# EAGLE board serv_open8_tsmc (EAGLE 9.6.2), part 1 of 2
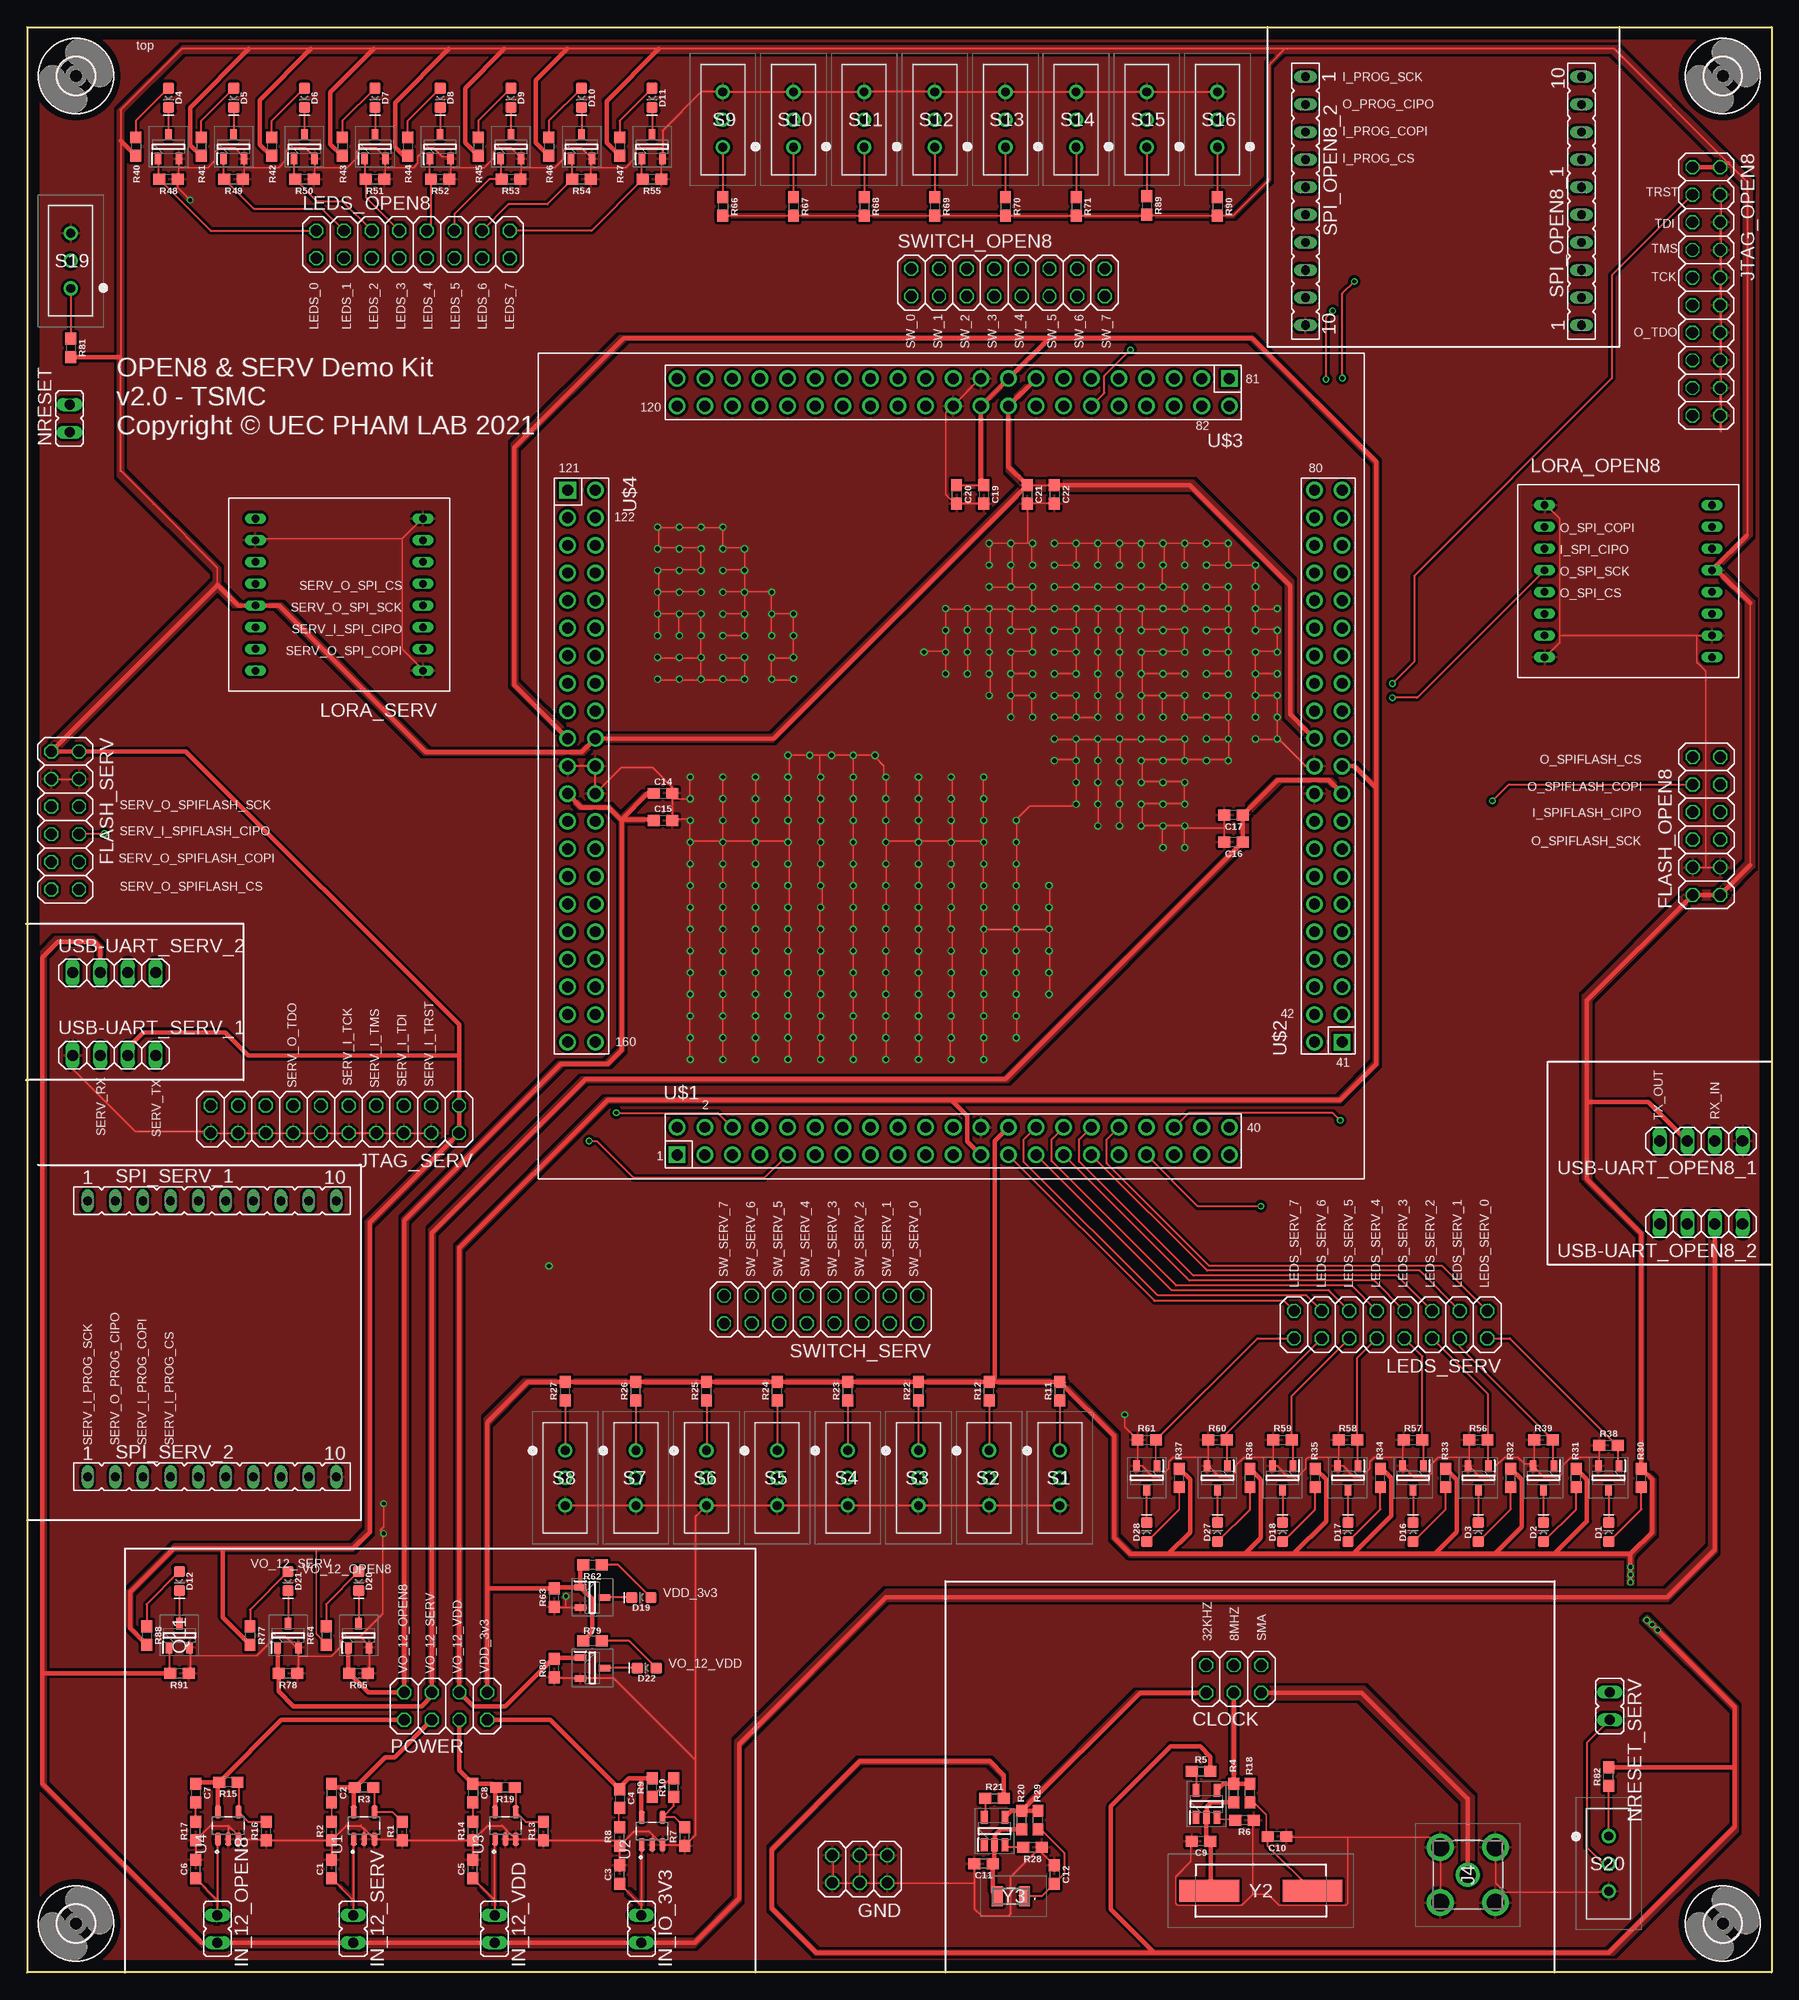
[diagram p9: board, top side]
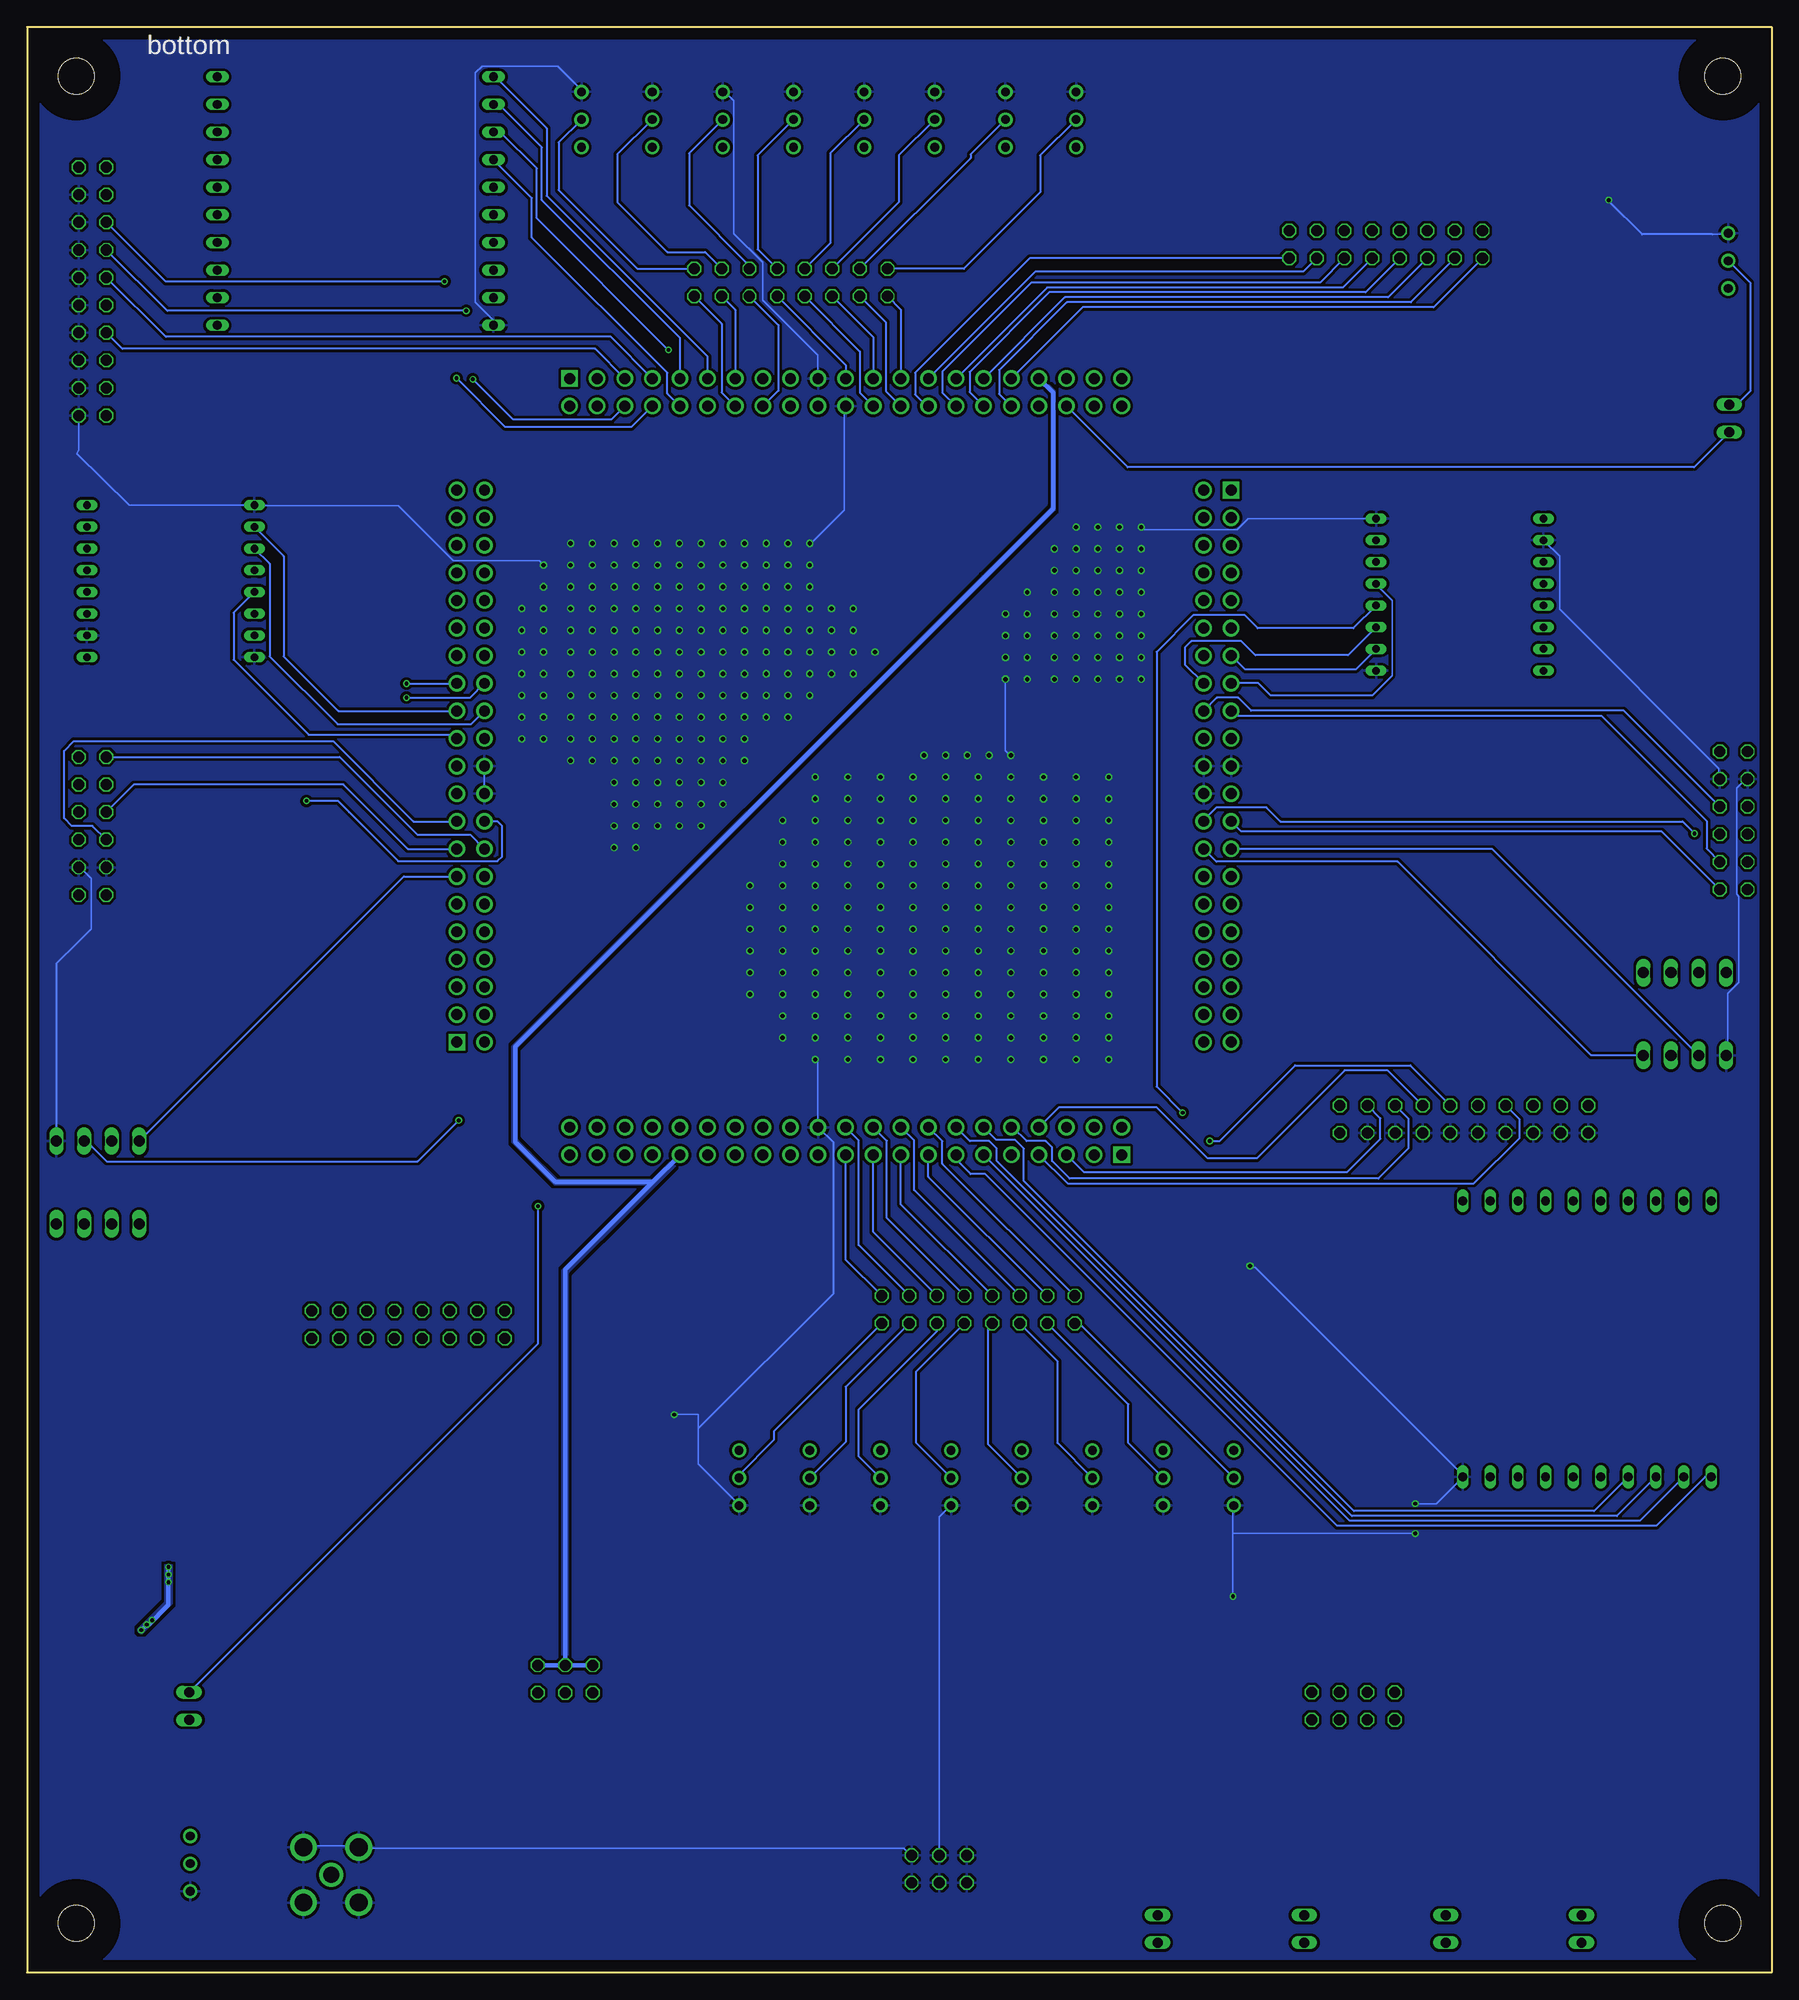
[diagram p10: board, bottom side, seen from below]

Size 160.5 x 179 mm. Coordinates in mm from the lower left corner, seen from the top.
Outline: 0,179 160.5,179 160.5,0 0,0 0,179
Copper layers (1*16): Top 0.035mm / dielectric 1.5mm / Bottom 0.035mm
Design rules "default *": minimum track width 6mil, minimum drill 0.35mm, track to track 10mil, track to pad 10mil, pad to pad 10mil, via to via 10mil, smd to smd 10mil, copper to edge 40mil, drill to drill 6mil, minimum pad ring 0.13mm, minimum via ring 0.13mm, stop-mask expansion 4mil, vias tented up to drill 0mil, thermal gap 10mil

## Footprints (pad centres in the part's own frame; a part is rotated, then mirrored left to right if it is on the bottom)
0603 = smd 1.1 x 1: 1 -0.85,0; 2 0.85,0
2X03 = drill 1.016 octagon: 1 -2.54,-1.27; 2 -2.54,1.27; 3 0,-1.27; 4 0,1.27; 5 2.54,-1.27; 6 2.54,1.27
LED-0603 = smd 1 x 1: A -0.877,0; C 0.877,0
2X06 = drill 1.016 octagon: 1 -6.35,-1.27; 2 -6.35,1.27; 3 -3.81,-1.27; 4 -3.81,1.27; 5 -1.27,-1.27; 6 -1.27,1.27; 7 1.27,-1.27; 8 1.27,1.27; 9 3.81,-1.27; 10 3.81,1.27; 11 6.35,-1.27; 12 6.35,1.27
3,3 = hole 3.3: 0,0
SOT95P280X145-5N = smd 1.2 x 0.6: 1 -1.25,0.95; 2 -1.25,0; 3 -1.25,-0.95; 4 1.25,-0.95; 5 1.25,0.95
JP1 = drill 0.914 long: 1 0,-1.27; 2 0,1.27
29856004 = drill 1.64 pad 2.46: 1 0,0; 2 5.08,0; 3 5.08,5.08; 4 0,5.08 | drill 1.47 pad 2.205: 5 2.54,2.54
2X10 = drill 1.016 octagon: 1 -11.43,-1.27; 2 -11.43,1.27; 3 -8.89,-1.27; 4 -8.89,1.27; 5 -6.35,-1.27; 6 -6.35,1.27; 7 -3.81,-1.27; 8 -3.81,1.27; 9 -1.27,-1.27; 10 -1.27,1.27; 11 1.27,-1.27; 12 1.27,1.27; 13 3.81,-1.27; 14 3.81,1.27; 15 6.35,-1.27; 16 6.35,1.27; 17 8.89,-1.27; 18 8.89,1.27; 19 11.43,-1.27; 20 11.43,1.27
2X08 = drill 1.016 octagon: 1 -8.89,-1.27; 2 -8.89,1.27; 3 -6.35,-1.27; 4 -6.35,1.27; 5 -3.81,-1.27; 6 -3.81,1.27; 7 -1.27,-1.27; 8 -1.27,1.27; 9 1.27,-1.27; 10 1.27,1.27; 11 3.81,-1.27; 12 3.81,1.27; 13 6.35,-1.27; 14 6.35,1.27; 15 8.89,-1.27; 16 8.89,1.27
RFM95-915S2 = drill 0.7 pad 0.7 long: P$1 -7.7,7; P$2 -7.7,5; P$3 -7.7,3; P$4 -7.7,1; P$5 -7.7,-1; P$6 -7.7,-3; P$7 -7.7,-5; P$8 -7.7,-7; P$9 7.7,7; P$10 7.7,5; P$11 7.7,3; P$12 7.7,1; P$13 7.7,-1; P$14 7.7,-3; P$15 7.7,-5; P$16 7.7,-7
2X04 = drill 1.016 octagon: 1 -3.81,-1.27; 2 -3.81,1.27; 3 -1.27,-1.27; 4 -1.27,1.27; 5 1.27,-1.27; 6 1.27,1.27; 7 3.81,-1.27; 8 3.81,1.27
SOT95P230X110-3N = smd 1.05 x 0.6: 1 -1.1,0.95; 2 -1.1,-0.95; 3 1.1,0
SS12SDP2 = drill 0.8 pad 1.3: 1 0,2.54; 2 0,0; 3 0,-2.54
FE10 = drill 0.813 long: 1 -11.43,0; 2 -8.89,0; 3 -6.35,0; 4 -3.81,0; 5 -1.27,0; 6 1.27,0; 7 3.81,0; 8 6.35,0; 9 8.89,0; 10 11.43,0
SOT95P280X145-5N' = smd 1.21 x 0.59: 1 -1.255,0.95; 2 -1.255,0; 3 -1.255,-0.95; 4 1.255,-0.95; 5 1.255,0.95
2X41_HEADER = drill 1 pad 1.524 square: 1 -25.4,-1.27 | drill 1 pad 1.524: 2 -25.4,1.27; 3 -22.86,-1.27; 4 -22.86,1.27; 5 -20.32,-1.27; 6 -20.32,1.27; 7 -17.78,-1.27; 8 -17.78,1.27; 9 -15.24,-1.27; 10 -15.24,1.27; 11 -12.7,-1.27; 12 -12.7,1.27; 13 -10.16,-1.27; 14 -10.16,1.27; 15 -7.62,-1.27; 16 -7.62,1.27; 17 -5.08,-1.27; 18 -5.08,1.27; 19 -2.54,-1.27; 20 -2.54,1.27; 21 0,-1.27; 22 0,1.27; 23 2.54,-1.27; 24 2.54,1.27; 25 5.08,-1.27; 26 5.08,1.27; 27 7.62,-1.27; 28 7.62,1.27; 29 10.16,-1.27; 30 10.16,1.27; 31 12.7,-1.27; 32 12.7,1.27; 33 15.24,-1.27; 34 15.24,1.27; 35 17.78,-1.27; 36 17.78,1.27; 37 20.32,-1.27; 38 20.32,1.27; 39 22.86,-1.27; 40 22.86,1.27; 41 25.4,-1.27; 42 25.4,1.27
1X04 = drill 1.016 long: 1 -3.81,0; 2 -1.27,0; 3 1.27,0; 4 3.81,0
HC49SM8MHZ20PF30PPM = smd 5.5 x 2: 1 -4.75,0; 2 4.75,0
Q13FC1350000400 = smd 1 x 1.8: 1 -1.25,0; 2 1.25,0

## Placement (x,y rotation side)
C1  1.0uF  [0603]  28,9.5 90 top
C2  4.7uF  [0603]  28,16.5 270 top
C3  1.0uF  [0603]  54.5,9 90 top
C4  4.7uF  [0603]  54.5,16 270 top
C5  1.0uF  [0603]  41,9.5 90 top
C6  1.0uF  [0603]  15.5,9.5 90 top
C7  4.7uF  [0603]  15.5,16.5 270 top
C8  4.7uF  [0603]  41,16.5 270 top
C9  36pF  [0603]  108,12.07 180 top
C10  36pF  [0603]  115,12.5 180 top
C11  22pF  [0603]  88,10 180 top
C12  22pF  [0603]  94.5,9 270 top
C14  0.1uF  [0603]  58.5,108.5 0 top
C15  10uF  [0603]  58.5,106 0 top
C16  0.1uF  [0603]  111,104 180 top
C17  10uF  [0603]  111,106.5 180 top
C19  0.1uF  [0603]  88,136 270 top
C20  10uF  [0603]  85.5,136 270 top
C21  0.1uF  [0603]  92,136 270 top
C22  10uF  [0603]  94.5,136 270 top
CLOCK  PINHD-2X3  [2X03]  111,27 0 top
D1  LED0  [LED-0603]  145.5,40.5 90 top
D2  LED0  [LED-0603]  139.5,40.5 90 top
D3  LED0  [LED-0603]  133.5,40.5 90 top
D4  LED0  [LED-0603]  13,172.5 270 top
D5  LED0  [LED-0603]  19,172.5 270 top
D6  LED0  [LED-0603]  25.5,172.5 270 top
D7  LED0  [LED-0603]  32,172.5 270 top
D8  LED0  [LED-0603]  38,172.5 270 top
D9  LED0  [LED-0603]  44.5,172.5 270 top
D10  LED0  [LED-0603]  51,172.5 270 top
D11  LED0  [LED-0603]  57.5,172.5 270 top
D12  LED0  [LED-0603]  14,36 270 top
D16  LED0  [LED-0603]  127.5,40.5 90 top
D17  LED0  [LED-0603]  121.5,40.5 90 top
D18  LED0  [LED-0603]  115.5,40.5 90 top
D19  LED0  [LED-0603]  56.5,34.5 180 top
D20  LED0  [LED-0603]  30.5,36 270 top
D21  LED0  [LED-0603]  24,36 270 top
D22  LED0  [LED-0603]  57,28 180 top
D27  LED0  [LED-0603]  109.5,40.5 90 top
D28  LED0  [LED-0603]  103,40.5 90 top
FLASH_OPEN8  PINHD-2X6  [2X06]  154.5,105.5 90 top
FLASH_SERV  PINHD-2X6  [2X06]  3.5,106 270 top
GND  PINHD-2X3  [2X03]  76.6,9.5 180 top
H1  MOUNT-HOLE3.3  [3,3]  156,4.5 0 top
H2  MOUNT-HOLE3.3  [3,3]  4.5,4.5 0 top
H3  MOUNT-HOLE3.3  [3,3]  4.5,174.5 0 top
H4  MOUNT-HOLE3.3  [3,3]  156,174.5 0 top
IC1  SN74LVC1GU04DBVR  [SOT95P280X145-5N]  108.5,15.5 90 top
IC2  SN74LVC1GU04DBVR  [SOT95P280X145-5N]  89,13 90 top
IN_12_OPEN8  REG_IN_OPEN8  [JP1]  17.5,4 0 top
IN_12_SERV  REG_IN_SERV  [JP1]  30,4 0 top
IN_12_VDD  REG_IN  [JP1]  43,4 0 top
IN_IO_3V3  REG_IN_IO  [JP1]  56.5,4 0 top
J4  2985-6004  [29856004]  130,11.5 270 top
JTAG_OPEN8  [2X10]  154.48,154.69 270 top
JTAG_SERV  [2X10]  28.3,78.5 180 top
LEDS_OPEN8  [2X08]  35.5,159 0 top
LEDS_SERV  [2X08]  125.44,59.61 180 top
LORA_OPEN8  [RFM95-915S2]  147.3,128.02 0 top
LORA_SERV  [RFM95-915S2]  28.7,126.78 180 top
NRESET  REG_IN  [JP1]  3.9,143 0 top
NRESET_SERV  REG_IN  [JP1]  145.6,24.5 180 top
POWER  PINHD-2X4  [2X04]  38.5,24.5 0 top
Q1  BSH103,235  [SOT95P230X110-3N]  145.5,45.5 270 top
Q2  BSH103,235  [SOT95P230X110-3N]  139.5,45.5 270 top
Q3  BSH103,235  [SOT95P230X110-3N]  13,168 90 top
Q4  BSH103,235  [SOT95P230X110-3N]  19,168 90 top
Q5  BSH103,235  [SOT95P230X110-3N]  25.5,168 90 top
Q6  BSH103,235  [SOT95P230X110-3N]  32,168 90 top
Q7  BSH103,235  [SOT95P230X110-3N]  38,168 90 top
Q8  BSH103,235  [SOT95P230X110-3N]  44.5,168 90 top
Q9  BSH103,235  [SOT95P230X110-3N]  51,168 90 top
Q10  BSH103,235  [SOT95P230X110-3N]  57.5,168 90 top
Q11  BSH103,235  [SOT95P230X110-3N]  14,31 90 top
Q14  BSH103,235  [SOT95P230X110-3N]  133.5,45.5 270 top
Q15  BSH103,235  [SOT95P230X110-3N]  127.5,45.5 270 top
Q16  BSH103,235  [SOT95P230X110-3N]  52,34.5 0 top
Q17  BSH103,235  [SOT95P230X110-3N]  30.5,31 90 top
Q18  BSH103,235  [SOT95P230X110-3N]  24,31 90 top
Q19  BSH103,235  [SOT95P230X110-3N]  52,28 0 top
Q25  BSH103,235  [SOT95P230X110-3N]  121.5,45.5 270 top
Q26  BSH103,235  [SOT95P230X110-3N]  115.5,45.5 270 top
Q27  BSH103,235  [SOT95P230X110-3N]  109.5,45.5 270 top
Q28  BSH103,235  [SOT95P230X110-3N]  103,45.5 270 top
R1  66.5KOHM-0603-1/10W-5%  [0603]  34.5,13 90 top
R2  1  [0603]  28,13 90 top
R3  53.6k  [0603]  31,17 180 top
R4  10M  [0603]  111,16.5 90 top
R5  47k  [0603]  108,18.5 0 top
R6  47k  [0603]  112,14 180 top
R7  66.5KOHM-0603-1/10W-5%  [0603]  60.5,12.5 90 top
R8  1  [0603]  54.5,12.5 90 top
R9  3k  [0603]  57.5,17 90 top
R10  243k  [0603]  59.5,17 90 top
R11  10k  [0603]  95,53.5 90 top
R12  10k  [0603]  88.5,53.5 90 top
R13  66.5KOHM-0603-1/10W-5%  [0603]  47.5,13 90 top
R14  1  [0603]  41,13 90 top
R15  53.6k  [0603]  18.5,17.5 180 top
R16  66.5KOHM-0603-1/10W-5%  [0603]  22,13 90 top
R17  1  [0603]  15.5,13 90 top
R18  2k  [0603]  112.5,16.5 90 top
R19  53.6k  [0603]  44,17 180 top
R20  10M  [0603]  91.5,14 90 top
R21  47k  [0603]  89,16 0 top
R22  10k  [0603]  82,53.5 90 top
R23  10k  [0603]  75.5,53.5 90 top
R24  10k  [0603]  69,53.5 90 top
R25  10k  [0603]  62.5,53.5 90 top
R26  10k  [0603]  56,53.5 90 top
R27  10k  [0603]  49.5,53.5 90 top
R28  47k  [0603]  92.5,11.5 180 top
R29  300k  [0603]  93,14 90 top
R30  330  [0603]  148.5,45.5 90 top
R31  330  [0603]  142.5,45.5 90 top
R32  330  [0603]  136.5,45.5 90 top
R33  330  [0603]  130.5,45.5 90 top
R34  330  [0603]  124.5,45.5 90 top
R35  330  [0603]  118.5,45.5 90 top
R36  330  [0603]  112.5,45.5 90 top
R37  330  [0603]  106,45.5 90 top
R38  10k  [0603]  145.5,48.5 0 top
R39  10k  [0603]  139.5,49 0 top
R40  330  [0603]  10,168 270 top
R41  330  [0603]  16,168 270 top
R42  330  [0603]  22.5,168 270 top
R43  330  [0603]  29,168 270 top
R44  330  [0603]  35,168 270 top
R45  330  [0603]  41.5,168 270 top
R46  330  [0603]  48,168 270 top
R47  330  [0603]  54.5,168 270 top
R48  10k  [0603]  13,165 180 top
R49  10k  [0603]  19,165 180 top
R50  10k  [0603]  25.5,165 180 top
R51  10k  [0603]  32,165 180 top
R52  10k  [0603]  38,165 180 top
R53  10k  [0603]  44.5,165 180 top
R54  10k  [0603]  51,165 180 top
R55  10k  [0603]  57.5,165 180 top
R56  10k  [0603]  133.5,49 0 top
R57  10k  [0603]  127.5,49 0 top
R58  10k  [0603]  121.5,49 0 top
R59  10k  [0603]  115.5,49 0 top
R60  10k  [0603]  109.5,49 0 top
R61  10k  [0603]  103,49 0 top
R62  330  [0603]  52,37.5 180 top
R63  10k  [0603]  48.5,34.5 90 top
R64  330  [0603]  27.5,31 270 top
R65  10k  [0603]  30.5,27.5 180 top
R66  10k  [0603]  64,162.5 270 top
R67  10k  [0603]  70.5,162.5 270 top
R68  10k  [0603]  77,162.5 270 top
R69  10k  [0603]  83.5,162.5 270 top
R70  10k  [0603]  90,162.5 270 top
R71  10k  [0603]  96.5,162.5 270 top
R77  330  [0603]  20.5,31 270 top
R78  10k  [0603]  24,27.5 180 top
R79  330  [0603]  52,30.5 180 top
R80  10k  [0603]  48.5,28 90 top
R81  10k  [0603]  4,149.5 270 top
R82  10k  [0603]  145.5,18 90 top
R88  330  [0603]  11,31 270 top
R89  10k  [0603]  103,162.59 270 top
R90  10k  [0603]  109.5,162.5 270 top
R91  10k  [0603]  14,27.5 180 top
S1  SS12SDP2  [SS12SDP2]  95,45.5 0 top
S2  SS12SDP2  [SS12SDP2]  88.5,45.5 0 top
S3  SS12SDP2  [SS12SDP2]  82,45.5 0 top
S4  SS12SDP2  [SS12SDP2]  75.5,45.5 0 top
S5  SS12SDP2  [SS12SDP2]  69,45.5 0 top
S6  SS12SDP2  [SS12SDP2]  62.5,45.5 0 top
S7  SS12SDP2  [SS12SDP2]  56,45.5 0 top
S8  SS12SDP2  [SS12SDP2]  49.5,45.5 0 top
S9  SS12SDP2  [SS12SDP2]  64,170.5 180 top
S10  SS12SDP2  [SS12SDP2]  70.5,170.5 180 top
S11  SS12SDP2  [SS12SDP2]  77,170.5 180 top
S12  SS12SDP2  [SS12SDP2]  83.5,170.5 180 top
S13  SS12SDP2  [SS12SDP2]  90,170.5 180 top
S14  SS12SDP2  [SS12SDP2]  96.5,170.5 180 top
S15  SS12SDP2  [SS12SDP2]  103,170.5 180 top
S16  SS12SDP2  [SS12SDP2]  109.5,170.5 180 top
S19  SS12SDP2  [SS12SDP2]  4,157.5 180 top
S20  SS12SDP2  [SS12SDP2]  145.5,10 0 top
SPI_OPEN8_1  SPI1  [FE10]  143,163 90 top
SPI_OPEN8_2  SPI0  [FE10]  117.6,163 270 top
SPI_SERV_1  SPI1  [FE10]  17,71 0 top
SPI_SERV_2  SPI0  [FE10]  17,45.6 0 top
SWITCH_OPEN8  [2X08]  90.24,155.5 0 top
SWITCH_SERV  [2X08]  73,61 180 top
U1  TPS76201DBVR  [SOT95P280X145-5N']  31,13.5 90 top
U2  TPS76201DBVR  [SOT95P280X145-5N']  57.5,13 90 top
U3  TPS76201DBVR  [SOT95P280X145-5N']  44,13.5 90 top
U4  TPS76201DBVR  [SOT95P280X145-5N']  18.5,13.5 90 top
U$1  [2X41_HEADER]  85.2,76.5 0 top
U$2  [2X41_HEADER]  119.7,111 90 top
U$3  [2X41_HEADER]  85.2,145.4 180 top
U$4  [2X41_HEADER]  51,111 270 top
USB-UART_OPEN8_1  PINHD-1X4  [1X04]  154,76.5 180 top
USB-UART_OPEN8_2  PINHD-1X4  [1X04]  154,68.88 180 top
USB-UART_SERV_1  PINHD-1X4  [1X04]  8,84.38 0 top
USB-UART_SERV_2  PINHD-1X4  [1X04]  8,92 0 top
Y2  HC-49SM8MHZ20PF30PPM  [HC49SM8MHZ20PF30PPM]  113.5,7.5 180 top
Y3  Q13FC1350000400  [Q13FC1350000400]  90.5,7 180 top